# EAGLE design XC9572XL-CPLDbreakout-v1a (EAGLE 5.11)
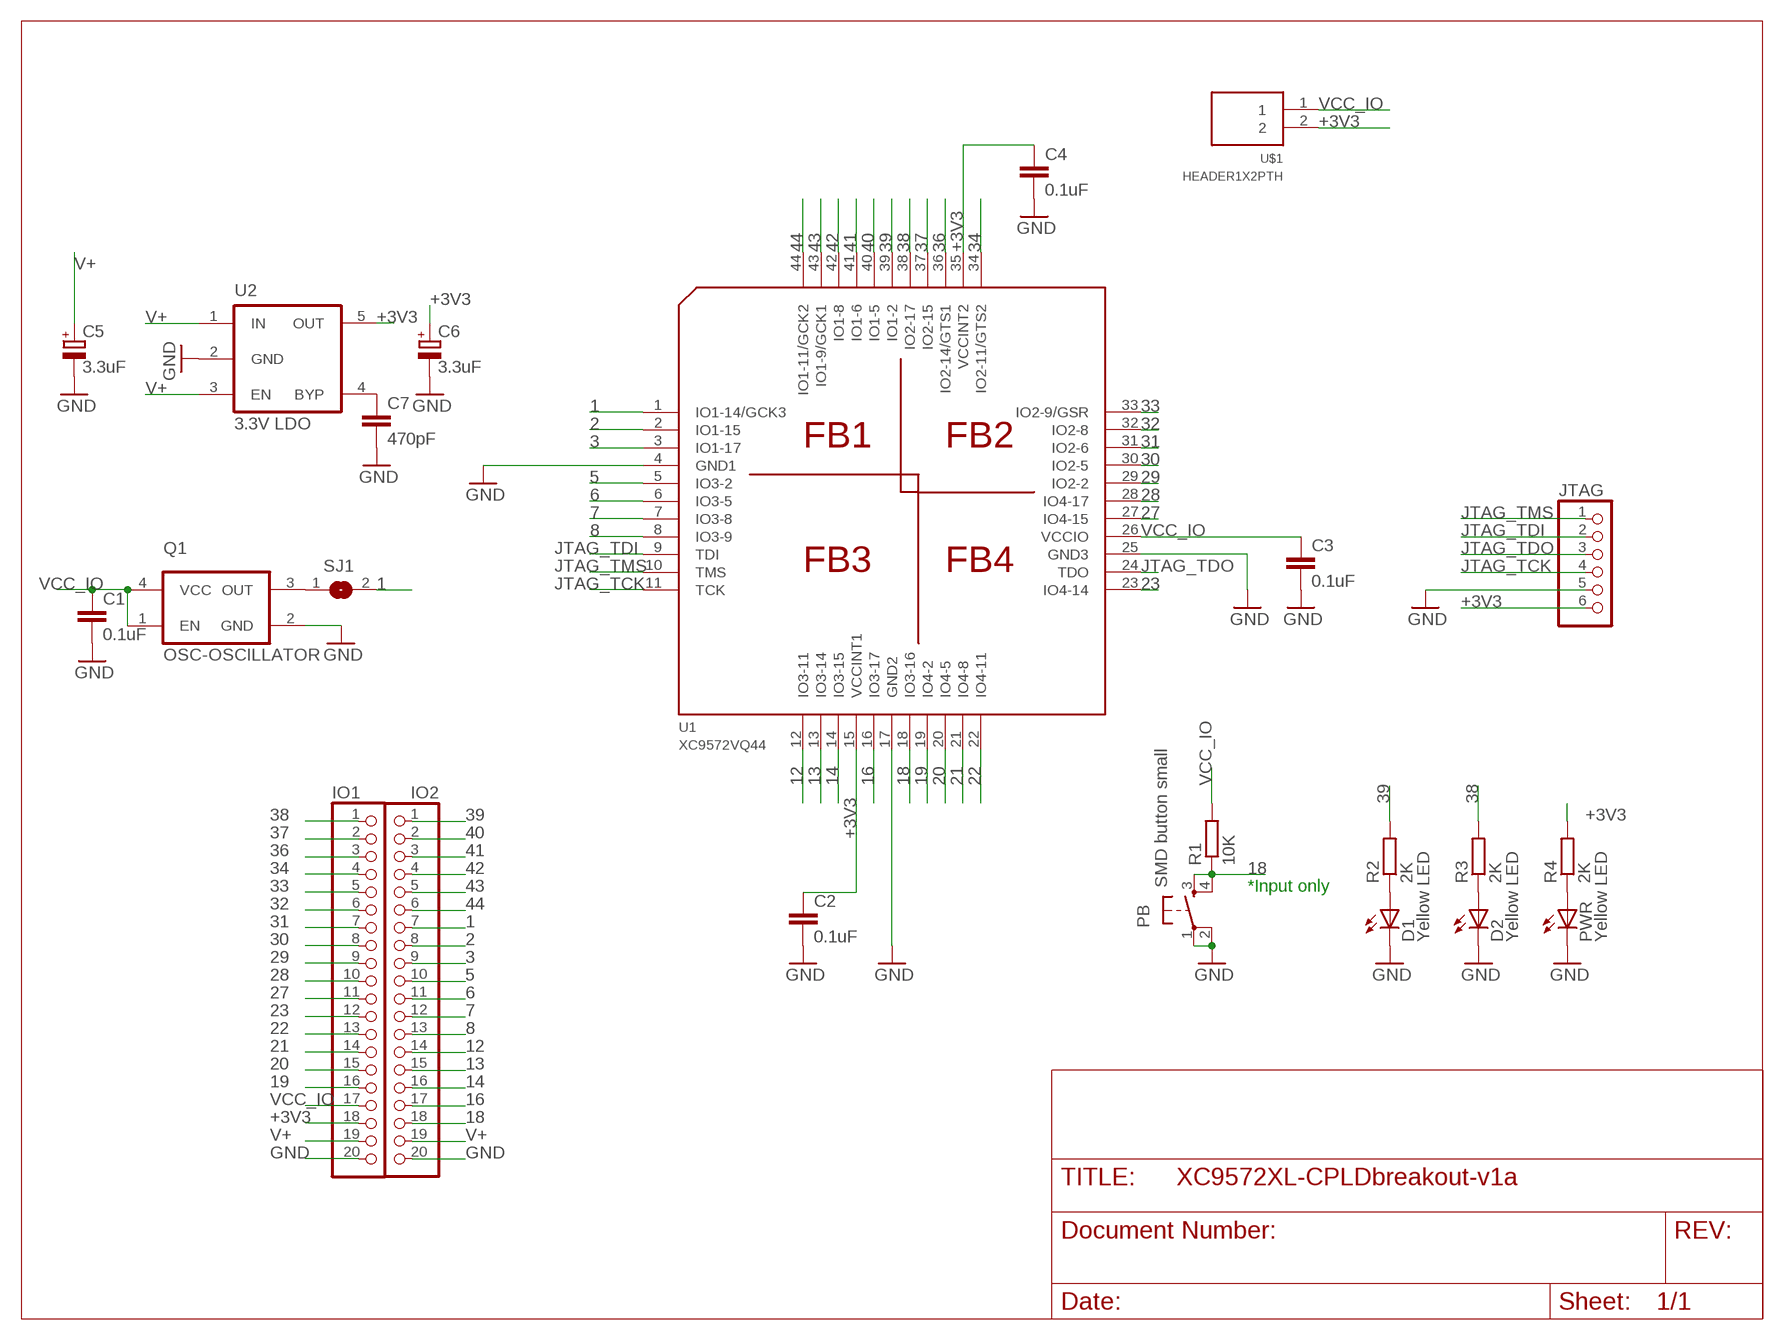
[diagram p0: schematic, sheet 1]

## Parts
C1  0.1uF  CAPC603  [C603]
C2  0.1uF  CAPC603  [C603]
C3  0.1uF  CAPC603  [C603]
C4  0.1uF  CAPC603  [C603]
C5  3.3uF  CAP_POLSMC_A  [SMC_A]
C6  3.3uF  CAP_POLSMC_A  [SMC_A]
C7  470pF  CAPC603  [C603]
D1  Yellow LED  LED805  [LED-805]
D2  Yellow LED  LED805  [LED-805]
IO1  PINHD-1X20  [1X20]
IO2  PINHD-1X20  [1X20]
JTAG  PINHD-1X6  [1X06]
PB  SMD button small  SMD_TACT_SMALL  [TACT_SWITCH_SMALL]
PWR  Yellow LED  LED805  [LED-805]
Q1  OSC-OSCILLATOR  [OSCILLATOR_7X5_SMD]
R1  10K  RESISTORR603  [R603]
R2  2K  RESISTORR603  [R603]
R3  2K  RESISTORR603  [R603]
R4  2K  RESISTORR603  [R603]
SJ1  SJ  [SJ]
U1  XC9572VQ44  [VQ44]
U2  3.3V LDO  MIC5205  [SOT-23-5]
U$1  HEADER1X2PTH  [M1X2]

## Nets
1: IO2.7 SJ1.2 U1.1(IO1-14/GCK3)
2: IO2.8 U1.2(IO1-15)
3: IO2.9 U1.3(IO1-17)
5: IO2.10 U1.5(IO3-2)
6: IO2.11 U1.6(IO3-5)
7: IO2.12 U1.7(IO3-8)
8: IO2.13 U1.8(IO3-9)
12: IO2.14 U1.12(IO3-11)
13: IO2.15 U1.13(IO3-14)
14: IO2.16 U1.14(IO3-15)
16: IO2.17 U1.16(IO3-17)
18: IO2.18 PB.3 PB.4 R1.1 U1.18(IO3-16)
19: IO1.16 U1.19(IO4-2)
20: IO1.15 U1.20(IO4-5)
21: IO1.14 U1.21(IO4-8)
22: IO1.13 U1.22(IO4-11)
23: IO1.12 U1.23(IO4-14)
27: IO1.11 U1.27(IO4-15)
28: IO1.10 U1.28(IO4-17)
29: IO1.9 U1.29(IO2-2)
30: IO1.8 U1.30(IO2-5)
31: IO1.7 U1.31(IO2-6)
32: IO1.6 U1.32(IO2-8)
33: IO1.5 U1.33(IO2-9/GSR)
34: IO1.4 U1.34(IO2-11/GTS2)
36: IO1.3 U1.36(IO2-14/GTS1)
37: IO1.2 U1.37(IO2-15)
38: IO1.1 R3.2 U1.38(IO2-17)
39: IO2.1 R2.2 U1.39(IO1-2)
40: IO2.2 U1.40(IO1-5)
41: IO2.3 U1.41(IO1-6)
42: IO2.4 U1.42(IO1-8)
43: IO2.5 U1.43(IO1-9/GCK1)
44: IO2.6 U1.44(IO1-11/GCK2)
+3V3: C2.1 C4.1 C6.+ IO1.18 JTAG.6 R4.2 U1.15(VCCINT1) U1.35(VCCINT2) U2.5(OUT) U$1.2
GND: C1.2 C2.2 C3.2 C4.2 C5.- C6.- C7.2 D1.C D2.C IO1.20 IO2.20 JTAG.5 PB.1 PB.2 PWR.C Q1.2(GND) U1.4(GND1) U1.17(GND2) U1.25(GND3) U2.2(GND)
JTAG_TCK: JTAG.4 U1.11(TCK)
JTAG_TDI: JTAG.2 U1.9(TDI)
JTAG_TDO: JTAG.3 U1.24(TDO)
JTAG_TMS: JTAG.1 U1.10(TMS)
N$1: D1.A R2.1
N$2: D2.A R3.1
N$3: PWR.A R4.1
N$4: C7.1 U2.4(BYP)
N$5: Q1.3(OUT) SJ1.1
V+: C5.+ IO1.19 IO2.19 U2.1(IN) U2.3(EN)
VCC_IO: C1.1 C3.1 IO1.17 Q1.1(EN) Q1.4(VCC) R1.2 U1.26(VCCIO) U$1.1

## Notes on the sheet
- *Input only

## Library data of the parts
C1-C4 C7 = dp_devices:CAP
C5 C6 = dp_devices:CAP_POL
D1 D2 PWR = dp_devices:LED
IO1 IO2 = pinhead:PINHD-1X20: PIN HEADER
JTAG = pinhead:PINHD-1X6: PIN HEADER
PB = dp_devices:SMD_TACT_SMALL
Q1 = dp_devices:OSC-OSCILLATOR: Oscillator
R1-R4 = dp_devices:RESISTOR
SJ1 = jumper:SJ: SMD solder JUMPER
U1 = dp_devices:XC9572
U2 = dp_devices:MIC5205: 150ma Low-Noise LDO Regulator
U$1 = dp_devices:HEADER1X2

## Board
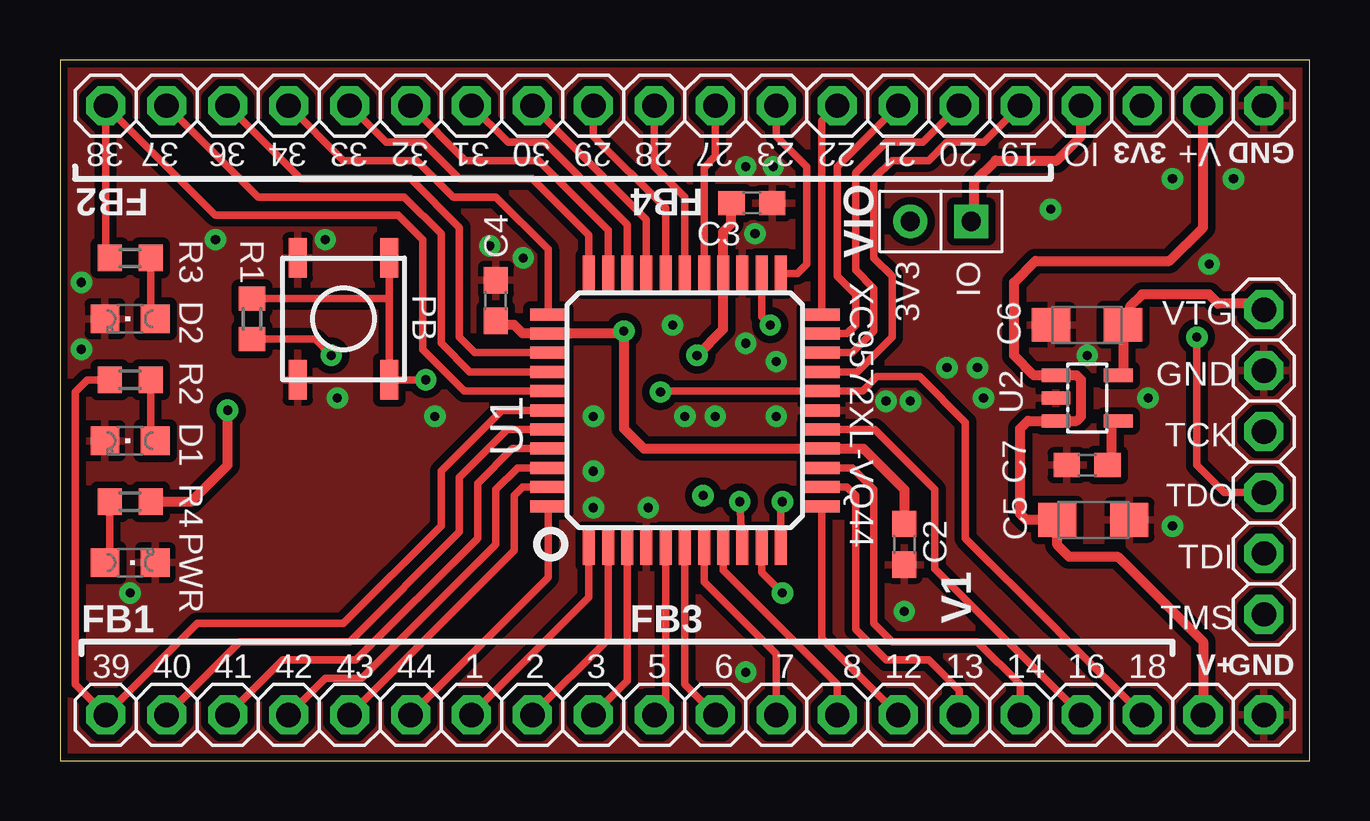
[diagram p1: board, top side]
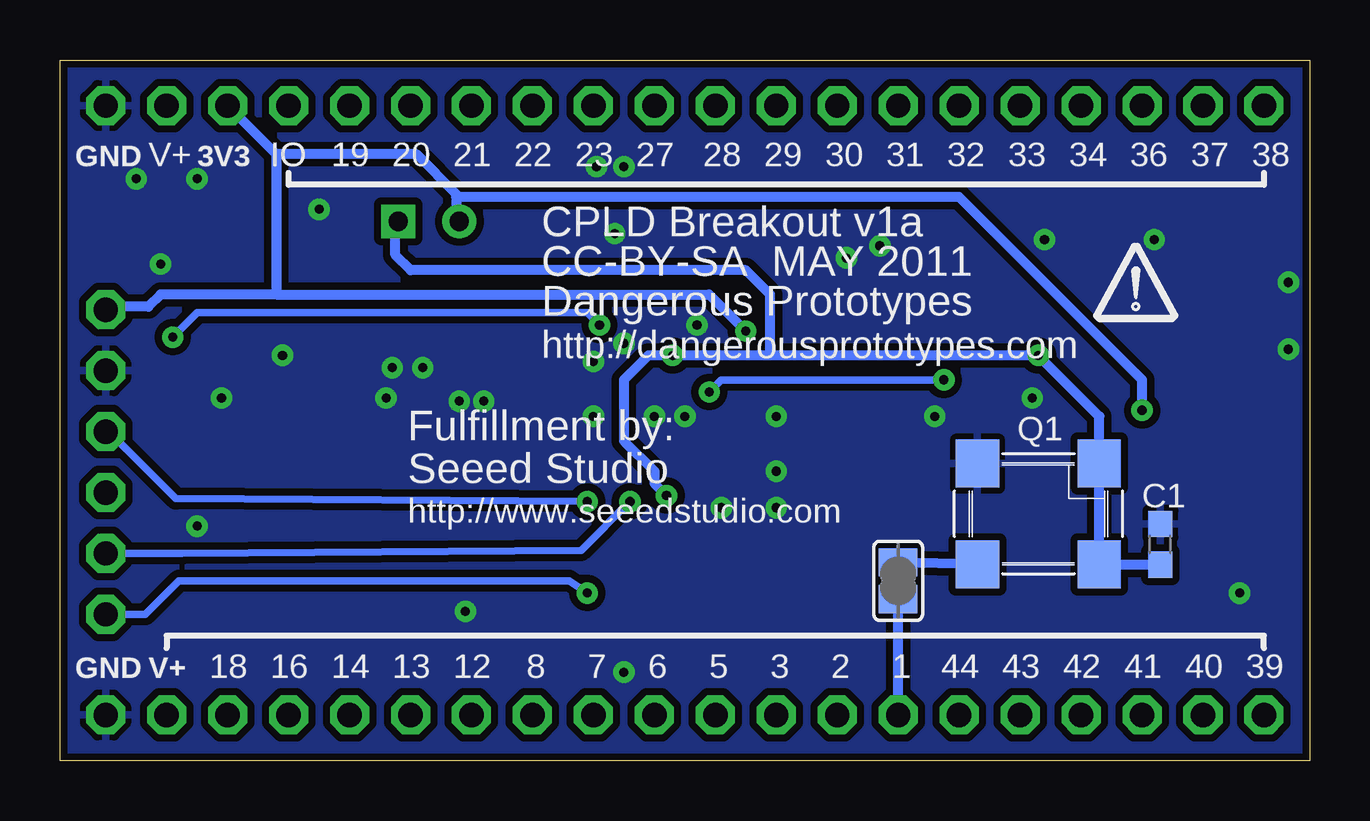
[diagram p2: board, bottom side, seen from below]

Size 52.07 x 29.21 mm. Coordinates in mm from the lower left corner, seen from the top.
Outline: 0,0 52.07,0 52.07,29.21 0,29.21 0,0
Copper layers (1*16): Top 0.035mm / dielectric 1.5mm / Bottom 0.035mm
Design rules "SparkFun": minimum track width 8mil, minimum drill 20mil, track to track 8mil, track to pad 8mil, pad to pad 8mil, via to via 8mil, smd to smd 8mil, copper to edge 10mil, drill to drill 8mil, minimum pad ring 12mil, minimum via ring 10mil, stop-mask expansion 4mil, vias tented up to drill 25mil, thermal gap 10mil

### Footprints (pad centres in the part's own frame; a part is rotated, then mirrored left to right if it is on the bottom)
C603 = smd 1.1 x 1: 1 -0.85,0; 2 0.85,0
SMC_A = smd 1.6 x 1.4: + -1.5,0; - 1.5,0
LED-805 = smd 1.2 x 1.2: A 0,-1.05; C 0,1.05
1X20 = drill 1.016 octagon: 1 -24.13,0; 2 -21.59,0; 3 -19.05,0; 4 -16.51,0; 5 -13.97,0; 6 -11.43,0; 7 -8.89,0; 8 -6.35,0; 9 -3.81,0; 10 -1.27,0; 11 1.27,0; 12 3.81,0; 13 6.35,0; 14 8.89,0; 15 11.43,0; 16 13.97,0; 17 16.51,0; 18 19.05,0; 19 21.59,0; 20 24.13,0
1X06 = drill 1.016 octagon: 1 -6.35,0; 2 -3.81,0; 3 -1.27,0; 4 1.27,0; 5 3.81,0; 6 6.35,0
TACT_SWITCH_SMALL = smd 1.651 x 0.762: 1 -2.54,1.905; 2 2.54,1.905; 3 -2.54,-1.905; 4 2.54,-1.905
OSCILLATOR_7X5_SMD = smd 1.8 x 2: 1 -2.54,-2.1; 2 2.54,-2.1; 3 2.54,2.1; 4 -2.54,2.1
R603 = smd 1 x 1.1: 1 -0.85,0; 2 0.85,0
SJ = smd 1.168 x 1.6: 1 -0.762,0; 2 0.762,0
VQ44 = smd 1.5 x 0.5: 1 -5.7,4; 2 -5.7,3.2; 3 -5.7,2.4; 4 -5.7,1.6; 5 -5.7,0.8; 6 -5.7,0; 7 -5.7,-0.8; 8 -5.7,-1.6; 9 -5.7,-2.4; 10 -5.7,-3.2; 11 -5.7,-4; 23 5.7,-4; 24 5.7,-3.2; 25 5.7,-2.4; 26 5.7,-1.6; 27 5.7,-0.8; 28 5.7,0; 29 5.7,0.8; 30 5.7,1.6; 31 5.7,2.4; 32 5.7,3.2; 33 5.7,4 | smd 0.5 x 1.5: 12 -4,-5.7; 13 -3.2,-5.7; 14 -2.4,-5.7; 15 -1.6,-5.7; 16 -0.8,-5.7; 17 0,-5.7; 18 0.8,-5.7; 19 1.6,-5.7; 20 2.4,-5.7; 21 3.2,-5.7; 22 4,-5.7; 34 4,5.7; 35 3.2,5.7; 36 2.4,5.7; 37 1.6,5.7; 38 0.8,5.7; 39 0,5.7; 40 -0.8,5.7; 41 -1.6,5.7; 42 -2.4,5.7; 43 -3.2,5.7; 44 -4,5.7
SOT-23-5 = smd 0.55 x 1.2: 1 -0.95,-1.3; 2 0,-1.3; 3 0.95,-1.3; 4 0.95,1.3; 5 -0.95,1.3
M1X2 = drill 0.8 square: 1 -1.27,0 | drill 0.8 round: 2 1.27,0

### Placement (x,y rotation side)
C1  6.22,9.02 90 bottom
C2  35.18,9.02 270 top
C3  28.83,23.24 0 top
C4  18.16,19.18 90 top
C5  43.05,10.03 0 top
C6  42.8,18.16 180 top
C7  42.8,12.32 180 top
D1  2.92,13.34 90 top
D2  2.92,18.41 90 top
IO1  26.04,27.3 0 top
IO2  26.04,1.91 0 top
JTAG  50.16,12.45 90 top
PB  11.81,18.41 90 top
PWR  2.92,8.26 270 top
Q1  11.3,10.29 180 bottom
R1  8,18.41 270 top
R2  2.92,15.88 180 top
R3  2.92,20.95 180 top
R4  2.92,10.79 0 top
SJ1  17.14,7.49 270 bottom
U1  26.04,14.61 90 top
U2  42.8,15.11 270 top
U$1  36.7,22.48 180 top
U$9  [DP_LOGO]  7.24,18.92 0 bottom

### Tracks (layer width: path | path; a pad name or v marks a point on that pad's centre or on a via)
1
  Top 0.305: U1.1 22.04,6.79 IO2.7
  Bottom 0.406: IO2.7 SJ1.2
2
  Top 0.305: U1.2 22.83,5.06 IO2.8
3
  Top 0.305: U1.3 23.63,3.32 IO2.9
5
  Top 0.305: U1.5 25.23,2.38 IO2.10
6
  Top 0.305: IO2.11 26.04,3.17 U1.6
7
  Top 0.305: U1.7 26.83,7.46 29.84,4.45 IO2.12
8
  Top 0.305: U1.8 27.63,7.93 32.39,3.17 IO2.13
12
  Top 0.305: U1.12 31.73,5.1 IO2.14
13
  Top 0.305: U1.13 32.79,11.4 33.15,11.05 33.15,5.46 34.42,4.19 36.2,4.19 37.47,2.92 IO2.15
14
  Top 0.305: U1.14 33.01,12.21 33.91,11.3 33.91,5.71 34.67,4.95 38.23,4.95 40.01,3.17 IO2.16
16
  Top 0.305: U1.16 33.95,13.8 36.45,11.3 36.45,8 IO2.17
18  (via drill 0.38)
  Top 0.305: 13.72,19.26 PB.4 | v15.24,15.88 PB.3 13.72,19.26 | R1.1 13.72,19.26 | v25.02,15.37 25.06,15.4 U1.18 33.44,15.4 34.04,16 35.81,16 37.72,14.1 37.72,9.27 41.27,5.71 41.91,5.08 IO2.18
  Bottom 0.305: v15.24,15.88 24.51,15.88 v25.02,15.37
19
  Top 0.305: U1.19 33.22,16.2 34.67,17.65 34.67,20.19 33.91,20.95 33.91,24.26 34.67,25.02 36.2,25.02 36.96,25.78 38.48,25.78 IO1.16
20
  Top 0.305: U1.20 33.01,17 33.91,17.91 33.91,19.68 33.15,20.45 33.15,24.51 34.42,25.78 35.94,25.78 IO1.15
21
  Top 0.305: U1.21 32.79,17.8 33.15,18.16 33.15,19.43 32.39,20.19 32.39,24.76 IO1.14
22
  Top 0.305: U1.22 31.73,26.68 IO1.13
23
  Top 0.305: U1.23 30.72,20.3 31.11,20.7 31.11,24.76 29.84,26.04 IO1.12
27
  Top 0.305: U1.27 26.83,24.73 27.3,25.2 IO1.11
28
  Top 0.305: U1.28 26.04,23.49 24.76,24.76 IO1.10
29
  Top 0.305: U1.29 25.23,23.02 22.22,26.04 IO1.9
30
  Top 0.305: U1.30 24.43,22.55 IO1.8
31
  Top 0.305: IO1.7 18.67,25.78 20.19,25.78 23.63,22.34 U1.31
32
  Top 0.305: IO1.6 16.89,25.02 19.94,25.02 22.83,22.12 U1.32
33
  Top 0.305: IO1.5 13.59,25.78 15.11,25.78 16.64,24.26 19.68,24.26 22.04,21.91 U1.33
34
  Top 0.305: U1.34 20.33,21.32 18.16,23.49 16.38,23.49 14.86,25.02 11.81,25.02 IO1.4
36
  Top 0.305: U1.36 17.29,17 16.64,17.65 16.64,22.22 14.61,24.26 10.03,24.26 IO1.3
37
  Top 0.305: U1.37 17.07,16.2 15.88,17.4 15.88,21.97 14.35,23.49 8.26,23.49 IO1.2
38
  Top 0.305: U1.38 16.85,15.4 15.11,17.14 15.11,21.72 14.1,22.73 6.48,22.73 IO1.1 1.91,21.21 2.07,21.04 R3.2
39
  Top 0.305: R2.2 1.14,15.88 0.64,15.37 0.64,3.17 IO2.1 5.71,5.71 11.81,5.71 15.88,9.78 15.88,12.06 18.41,14.61 U1.39
40
  Top 0.305: U1.40 18.63,13.8 16.64,11.81 16.64,9.53 12.06,4.95 7.49,4.95 IO2.2
41
  Top 0.305: U1.41 18.85,13.01 17.4,11.56 17.4,9.27 12.32,4.19 9.27,4.19 IO2.3
42
  Top 0.305: U1.42 19.06,12.21 18.16,11.3 18.16,9.02 12.57,3.43 11.05,3.43 IO2.4
43
  Top 0.305: U1.43 19.28,11.4 18.92,11.05 18.92,8.76 IO2.5
44
  Top 0.305: U1.44 20.33,7.63 IO2.6
+3V3  (via drill 0.38)
  Top 0.406: U2.5 44.3,16.26 C6.+ 44.58,18.16 44.58,18.92 45.09,19.43 47.88,19.43 48.26,19.05 49.91,19.05 JTAG.6 | C2.1 35.18,11.3 33.48,13.01 U1.15 24.33,13.01 23.49,13.84 v23.49,17.91 23.39,17.8 U1.35 19.28,17.8 18.92,18.16 18.33,18.16 C4.1 | R4.2 5.46,10.79 6.99,12.32 v6.99,14.61
  Bottom 0.406: 35.56,23.49 35.56,23.62 37.21,25.27 43.05,25.27 | 43.05,25.27 IO1.18 | v6.99,14.61 6.99,15.88 14.61,23.49 35.56,23.49 | v23.49,17.91 25.02,19.43 43.05,19.43 | 43.05,19.43 47.88,19.43 48.39,18.92 50.04,18.92 JTAG.6 | 35.56,23.49 35.56,22.61 U$1.2 | 43.05,25.27 43.05,19.43
GND  (via drill 0.38)
  other vias: 17.91,21.46 35.18,6.22 24.51,10.54 28.57,3.68 29.72,24.76 38.48,15.11 38.23,16.38 46.36,9.78 34.42,14.99 25.53,18.16 19.3,20.95 28.57,17.4 22.22,10.54 35.43,14.99 36.96,16.38 45.34,15.11 0.89,17.14 0.89,19.94 2.92,6.99 46.36,24.26 48.9,24.26 42.8,16.89 22.22,12.06 22.22,14.35 28.57,24.76 11.05,21.72 6.48,21.72 11.56,15.11 15.62,14.35 28.96,21.97 27.3,14.35 26.04,14.35 29.84,16.64 29.84,14.35 47.88,20.7 41.27,22.99
  pour Bottom (isolate 0.305): 0,0 52.07,0 52.07,29.21 0,29.21
  pour Top (isolate 0.305): -0.64,-0.64 52.71,-0.64 52.71,29.84 -0.64,29.84
JTAG_TCK  (via drill 0.38)
  Top 0.305: v30.1,10.79 30.04,10.61 U1.11
  Bottom 0.305: JTAG.4 50.16,13.84 47.24,10.92 v30.1,10.79
JTAG_TDI  (via drill 0.38)
  Top 0.305: U1.9 v28.32,10.79
  Bottom 0.305: v28.32,10.79 30.35,8.76 46.99,8.64 JTAG.2
JTAG_TDO  (via drill 0.38)
  Top 0.305: JTAG.3 48.51,11.18 47.37,12.32 v47.37,17.65 | v29.59,18.16 29.23,18.52 U1.24
  Bottom 0.305: v47.37,17.65 46.36,18.67 30.1,18.67 v29.59,18.16
JTAG_TMS  (via drill 0.38)
  Top 0.305: v30.1,6.99 29.23,7.85 U1.10
  Bottom 0.305: JTAG.1 48.51,6.1 47.12,7.49 30.86,7.49 v30.1,6.99
N$1
  Top 0.305: R2.1 3.77,13.28 D1.A
N$2
  Top 0.305: R3.1 3.77,18.61 D2.A
N$3
  Top 0.305: R4.1 2.07,8.46 PWR.A
N$4
  Top 0.406: U2.4 43.88,14.16 43.82,14.1 43.82,12.48 C7.1
N$5
  Bottom 0.406: Q1.3 SJ1.1
V+
  Top 0.406: IO1.19 47.62,22.22 46.23,20.83 40.64,20.83 39.75,19.94 39.75,16.89 40.58,16.06 U2.1 42.36,16.06 42.55,15.88 42.55,14.35 42.36,14.16 U2.3 40.33,14.16 40.01,13.84 40.01,10.29 40.26,10.03 C5.+ 41.55,8.99 42.04,8.51 44.07,8.51 47.62,4.95 IO2.19
VCC_IO  (via drill 0.38)
  Top 0.305: R1.2 10.63,17.56 v11.3,16.89
  Top 0.406: C3.1 27.98,22.39 27.63,22.05 U1.26 27.63,17.98 v26.54,16.89 | IO1.17 42.55,26.04 41.53,25.02 38.99,25.02 38.1,24.13 38.1,22.61 U$1.1 | v26.8,11.05 26.83,11.01
  Bottom 0.406: 22.48,16.89 v11.3,16.89 8.76,14.35 Q1.1 Q1.4 8.49,8.17 C1.1 | 22.48,16.89 v26.54,16.89 27.56,16.89 28.57,15.88 28.57,13.34 27.3,12.06 27.3,11.56 v26.8,11.05 26.83,11.01 | 22.48,16.89 22.48,19.43 23.49,20.45 37.47,20.45 38.1,21.08 38.1,22.35 U$1.1

### Text on the board
tNames: 38 | 37 | 36 | 34 | 33 | 32 | 31 | 30 | 29 | 28 | 27 | 23 | 22 | 21 | 20 | 19 | IO | 3V3 | V+ | GND | FB2 | FB4 | VIO | XC9572XL-VQ44 | 3V3 | IO | VTG | GND | TCK | TDO | TDI | TMS | FB1 | FB3 | V1 | 39 | 40 | 41 | 42 | 43 | 44 | 1 | 2 | 3 | 5 | 6 | 7 | 8 | 12 | 13 | 14 | 16 | 18 | V+ | GND
bNames: 38 | 37 | 36 | 34 | 33 | 32 | 31 | 30 | 29 | 28 | 27 | 23 | 22 | 21 | 20 | 19 | IO | IO | 3V3 | V+ | GND | CPLD Breakout v1a | CC-BY-SA MAY 2011 | Dangerous Prototypes | http://dangerousprototypes.com | Fulfillment by: | Seeed Studio | http://www.seeedstudio.com | 39 | 40 | 41 | 42 | 43 | 44 | 1 | 2 | 3 | 5 | 6 | 7 | 8 | 12 | 13 | 14 | 16 | 18 | V+ | GND
tDocu: Dangerous Prototypes | CPLD Breakout v1a | CC-BY-SA